# Altium schematic sheet digital_signal_8.SchDoc
size A4
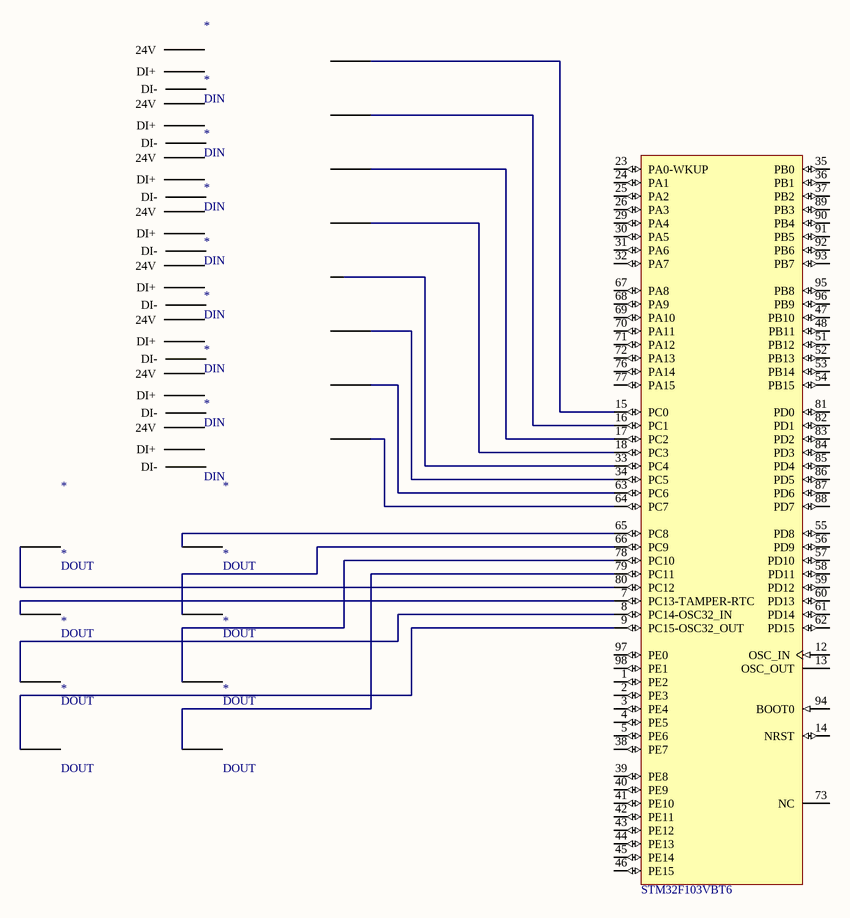
[diagram p0: digital_signal_8.SchDoc]

## Parts
(Parts that share a designator on the sheet are numbered #1, #2 ... from top to bottom, then left to right.)
*#1  DIN
*#2  DIN
*#3  DIN
*#4  DIN
*#5  DIN
*#6  DIN
*#7  DIN
*#8  DIN
*#9  DOUT
*#10  DOUT
*#11  DOUT
*#12  DOUT
*#13  DOUT
*#14  DOUT
*#15  DOUT
*#16  DOUT
U?  STM32F103VBT6  [STM-LQFP100_N]  (part A of 2)

## Nets

Not connected (* = marked no-connect by the designer): *#1 62(24V) 63(DI+) 64(DI-) 65; *#2 62(24V) 63(DI+) 64(DI-) 65; *#3 62(24V) 63(DI+) 64(DI-) 65; *#4 62(24V) 63(DI+) 64(DI-) 65; *#5 62(24V) 63(DI+) 64(DI-) 65; *#6 62(24V) 63(DI+) 64(DI-) 65; *#7 62(24V) 63(DI+) 64(DI-) 65; *#8 62(24V) 63(DI+) 64(DI-) 65; *#9 66; *#10 66; *#11 66; *#12 66; *#13 66; *#14 66; *#15 66; *#16 66; U? 1(PE2) 2(PE3) 3(PE4) 4(PE5) 5(PE6) 7(PC13-TAMPER-RTC) 8(PC14-OSC32_IN) 9(PC15-OSC32_OUT) 12(OSC_IN) 13(OSC_OUT) 14(NRST) 15(PC0) 16(PC1) 17(PC2) 18(PC3) 23(PA0-WKUP) 24(PA1) 25(PA2) 26(PA3) 29(PA4) 30(PA5) 31(PA6) 32(PA7) 33(PC4) 34(PC5) 35(PB0) 36(PB1) 37(PB2) 38(PE7) 39(PE8) 40(PE9) 41(PE10) 42(PE11) 43(PE12) 44(PE13) 45(PE14) 46(PE15) 47(PB10) 48(PB11) 51(PB12) 52(PB13) 53(PB14) 54(PB15) 55(PD8) 56(PD9) 57(PD10) 58(PD11) 59(PD12) 60(PD13) 61(PD14) 62(PD15) 63(PC6) 64(PC7) 65(PC8) 66(PC9) 67(PA8) 68(PA9) 69(PA10) 70(PA11) 71(PA12) 72(PA13) 73(NC) 76(PA14) 77(PA15) 78(PC10) 79(PC11) 80(PC12) 81(PD0) 82(PD1) 83(PD2) 84(PD3) 85(PD4) 86(PD5) 87(PD6) 88(PD7) 89(PB3) 90(PB4) 91(PB5) 92(PB6) 93(PB7) 94(BOOT0) 95(PB8) 96(PB9) 97(PE0) 98(PE1)

## Library data of the parts
U? = STM32F103VBT6: ARM Cortex-M3 32-bit MCU, 128 KB Flash, 20 KB Internal RAM, 80 I/Os, 100-pin LQFP, -40 to 85 degC, Tray; A/D Converter: 2x12-bit (16 channel); FLASH Size (Prog) (kB): 128; I/Os (High Current): 80; Internal RAM Size (kB): 20; Operating Frequency(F) (Processor speed) (MHz): 72; Supply Voltage(Vcc) min (V): 2; DatasheetVersion: Rev. 16; PackageVersion: Rev. 1, 06/2013; PackageReference: LQFP100; PackageDescription: 100-Pin Low Profile Quad Flat Package, 14 x 14 mm Body, 0.5 mm Pitch; Supplier 1: Digi-Key; Supplier Part Number 1: 497-6070-ND; Supplier 2: Farnell; Supplier Part Number 2: 1447641; Supplier 3: Newark; Supplier Part Number 3: 57P1252; Supplier 4: Mouser; Supplier Part Number 4: 511-STM32F103VBT6; Core: ARM Cortex-M3; Packing: Tray; Mounting Technology: Surface Mount; PartNumber: STM32F103VBT6; ComponentLink1Description: Manufacturer URL; ComponentLink1URL: http://www.st.com/web/en/home.html; ComponentLink2Description: Datasheet; ComponentLink2URL: http://www.st.com/st-web-ui/static/active/en/resource/technical/document/datasheet/CD00161566.pdf; ComponentLink3Description: Package Specification; ComponentLink3URL: http://www.st.com/st-web-ui/static/active/en/resource/technical/document/data_brief/DM00071938.pdf